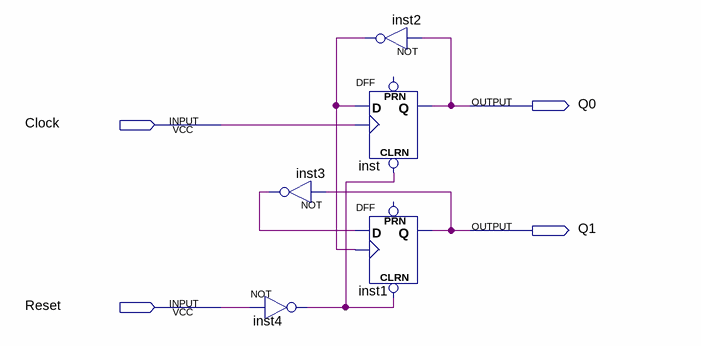
[diagram p0: schematic sheet]
// Quartus schematic Sequencer.bdf as structural Verilog: 5 symbols, 4 pins
module Sequencer (
  input  Clock,
  input  Reset,
  output Q0,
  output Q1
);

  wire inst2_out, inst3_out, inst4_out;

  not inst3 (inst3_out, Q1);
  not inst4 (inst4_out, Reset);
  DFF inst (.CLRN(inst4_out), .CLK(Clock), .D(inst2_out), .Q(Q0));  // open: PRN
  DFF inst1 (.CLRN(inst4_out), .CLK(inst2_out), .D(inst3_out), .Q(Q1));  // open: PRN
  not inst2 (inst2_out, Q0);
endmodule
